# Altium project CXQuadcopter.PrjPCB
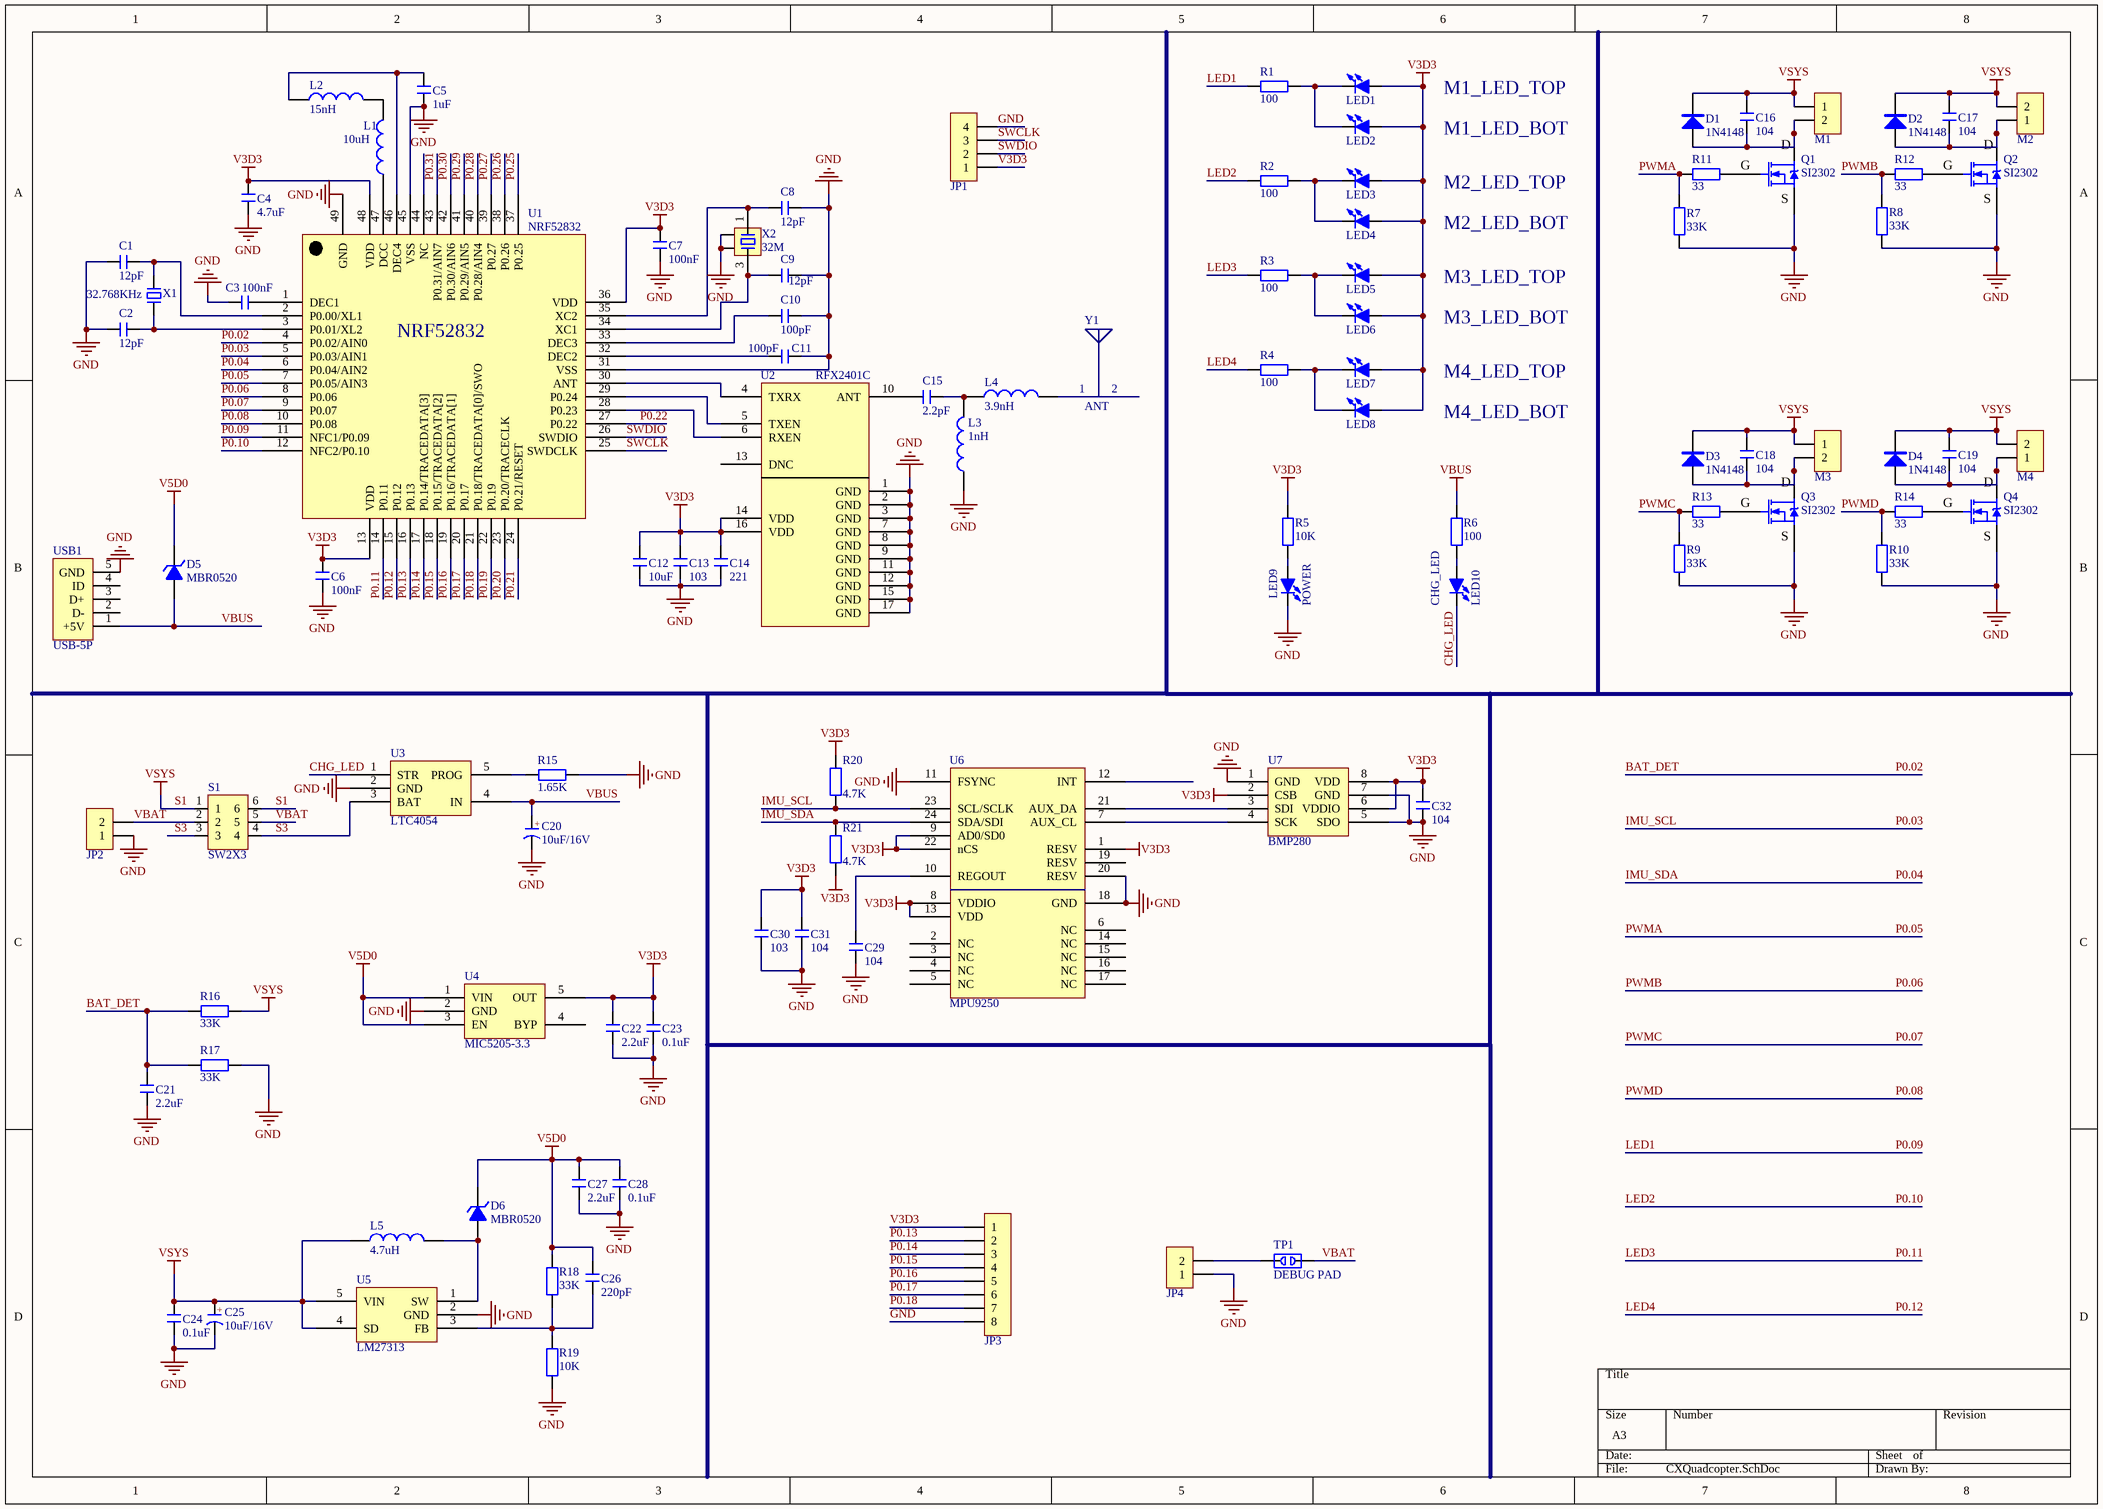
[diagram p0: CXQuadcopter.SchDoc]
1 sheet, 99 parts. Net scope: global (net labels, ports and power ports of the same name join across sheets).

## Sheet CXQuadcopter.SchDoc
size A3

### Parts
C1  12pF  [C 0402]
C2  12pF  [C 0402]
C3  100nF  [C 0402]
C4  4.7uF  [C 0402]
C5  1uF  [C 0402]
C6  100nF  [C 0402]
C7  100nF  [C 0402]
C8  12pF  [C 0402]
C9  12pF  [C 0402]
C10  100pF  [C 0402]
C11  100pF  [C 0402]
C12  10uF  [C 0402]
C13  103  [C 0402]
C14  221  [C 0402]
C15  2.2pF  [C 0402]
C16  104  [C 0402]
C17  104  [C 0402]
C18  104  [C 0402]
C19  104  [C 0402]
C20  10uF/16V  [CD A(3216)]
C21  2.2uF  [C 0603]
C22  2.2uF  [C 0603]
C23  0.1uF  [C 0603]
C24  0.1uF  [C 0603]
C25  10uF/16V  [CD A(3216)]
C26  220pF  [C 0603]
C27  2.2uF  [C 0603]
C28  0.1uF  [C 0603]
C29  104  [C 0603]
C30  103  [C 0603]
C31  104  [C 0603]
C32  104  [C 0603]
D1  1N4148  [MINI_MELF (LL34)]
D2  1N4148  [MINI_MELF (LL34)]
D3  1N4148  [MINI_MELF (LL34)]
D4  1N4148  [MINI_MELF (LL34)]
D5  MBR0520  [DO-35]
D6  MBR0520  [DO-35]
JP1  HDR-1X4  [HDR2.54 S-W-4P]  (value not drawn)
JP2  HDR-1X2  [HDR-1X2]  (value not drawn)
JP3  HDR-1X8  [HDR2.54 S-W-8P_M]  (value not drawn)
JP4  HDR-1X2  [HDR-1X2]  (value not drawn)
L1  10uH  [L 0402]
L2  15nH  [L 0402]
L3  1nH  [L 0402]
L4  3.9nH  [L 0402]
L5  4.7uH  [L 0402]
LED1  红色  [LED 0603R]  (value not drawn)
LED2  红色  [LED 0603R]  (value not drawn)
LED3  红色  [LED 0603R]  (value not drawn)
LED4  红色  [LED 0603R]  (value not drawn)
LED5  红色  [LED 0603R]  (value not drawn)
LED6  红色  [LED 0603R]  (value not drawn)
LED7  红色  [LED 0603R]  (value not drawn)
LED8  红色  [LED 0603R]  (value not drawn)
LED9  POWER  [LED 0603R]
LED10  CHG_LED  [LED 0603R]
M1  HDR-1X2  [HDR-1X2]  (value not drawn)
M2  HDR-1X2  [HDR-1X2]  (value not drawn)
M3  HDR-1X2  [HDR-1X2]  (value not drawn)
M4  HDR-1X2  [HDR-1X2]  (value not drawn)
Q1  SI2302  [SOT23-3N]
Q2  SI2302  [SOT23-3N]
Q3  SI2302  [SOT23-3N]
Q4  SI2302  [SOT23-3N]
R1  100  [R 0603]
R2  100  [R 0603]
R3  100  [R 0603]
R4  100  [R 0603]
R5  10K  [R 0603]
R6  100  [R 0603]
R7  33K  [R 0603]
R8  33K  [R 0603]
R9  33K  [R 0603]
R10  33K  [R 0603]
R11  33  [R 0603]
R12  33  [R 0603]
R13  33  [R 0603]
R14  33  [R 0603]
R15  1.65K  [R 0603]
R16  33K  [R 0603]
R17  33K  [R 0603]
R18  33K  [R 0603]
R19  10K  [R 0603]
R20  4.7K  [R 0603]
R21  4.7K  [R 0603]
S1  SW2X3
TP1  DEBUG PAD  [DEBUG PAD2]
U1  NRF52832
U2  RFX2401C
U3  LTC4054
U4  MIC5205-3.3
U5  LM27313
U6  MPU9250
U7  BMP280
USB1  USB-5P  [USB-MICRO_A]
X1  32.768KHz  [XTAL-3X8H]
X2  32M  [XTAL-5032]
Y1  ANT

### Nets
GND: C1.1 C2.1 C3.1 C4.1 C5.1 C6.1 C7.1 C8.2 C9.2 C10.2 C11.2 C12.1 C13.1 C14.1 C20.2(K) C21.1 C22.1 C23.1 C24.1 C25.2(K) C27.1 C28.1 C29.1 C30.1 C31.1 C32.1 JP1.4 JP2.1 JP3.8 JP4.1 L3.1 LED9.2(K) Q1.2(S) Q2.2(S) Q3.2(S) Q4.2(S) R7.1 R8.1 R9.1 R10.1 R15.2 R17.2 R19.1 U1.31(VSS) U1.45(VSS) U1.49(GND) U2.1(GND) U2.2(GND) U2.3(GND) U2.7(GND) U2.8(GND) U2.9(GND) U2.11(GND) U2.12(GND) U2.15(GND) U2.17(GND) U3.2(GND) U4.2(GND) U5.2(GND) U6.11(FSYNC) U6.18(GND) U6.20(RESV) U7.1(GND) U7.5(SDO) U7.7(GND) USB1.5(GND) X2.2 X2.4
S1: C16.1 C17.1 C18.1 C19.1 C24.2 C25.1(A) D1.2(K) D2.2(K) D3.2(K) D4.2(K) L5.1 M1.1 M2.2 M3.1 M4.2 R16.2 S1.1 S1.6 U5.4(SD) U5.5(VIN)  [also labelled VSYS]
V3D3: C4.2 C6.2 C7.2 C12.2 C13.2 C14.2 C22.2 C23.2 C30.2 C31.2 C32.2 JP1.1 JP3.1 LED1.1(A) LED2.1(A) LED3.1(A) LED4.1(A) LED5.1(A) LED6.1(A) LED7.1(A) LED8.1(A) R5.1 R20.2 R21.1 U1.13(VDD) U1.36(VDD) U1.48(VDD) U2.14(VDD) U2.16(VDD) U4.5(OUT) U6.1(RESV) U6.8(VDDIO) U6.9(AD0/SD0) U6.13(VDD) U6.22(nCS) U7.2(CSB) U7.6(VDDIO) U7.8(VDD)
V5D0: C26.2 C27.2 C28.2 D5.2(K) D6.2(K) R18.2 U4.1(VIN) U4.3(EN)
VBUS: C20.1(A) D5.1(A) R6.1 U3.4(IN) USB1.1(+5V)
BAT_DET: C21.2 R16.1 R17.1 U1.4(P0.02/AIN0)  [also labelled P0.02]
CHG_LED: LED10.2(K) U3.1(STR)
IMU_SCL: R20.1 U1.5(P0.03/AIN1) U6.23(SCL/SCLK)  [also labelled P0.03]
IMU_SDA: R21.2 U1.6(P0.04/AIN2) U6.24(SDA/SDI)  [also labelled P0.04]
LED1: R1.2 U1.11(NFC1/P0.09)  [also labelled P0.09]
LED2: R2.2 U1.12(NFC2/P0.10)  [also labelled P0.10]
LED3: R3.2 U1.14(P0.11)  [also labelled P0.11]
LED4: R4.2 U1.15(P0.12)  [also labelled P0.12]
P0.05: R7.2 R11.2 U1.7(P0.05/AIN3)  [also labelled PWMA]
P0.06: R8.2 R12.2 U1.8(P0.06)  [also labelled PWMB]
P0.07: R9.2 R13.2 U1.9(P0.07)  [also labelled PWMC]
P0.08: R10.2 R14.2 U1.10(P0.08)  [also labelled PWMD]
P0.13: JP3.2 U1.16(P0.13)
P0.14: JP3.3 U1.17(P0.14/TRACEDATA[3])
P0.15: JP3.4 U1.18(P0.15/TRACEDATA[2])
P0.16: JP3.5 U1.19(P0.16/TRACEDATA[1])
P0.17: JP3.6 U1.20(P0.17)
P0.18: JP3.7 U1.21(P0.18/TRACEDATA[0]/SWO)
P0.19: U1.22(P0.19)
P0.20: U1.23(P0.20/TRACECLK)
P0.21: U1.24(P0.21/RESET)
P0.22: U1.27(P0.22)
P0.25: U1.37(P0.25)
P0.26: U1.38(P0.26)
P0.27: U1.39(P0.27)
P0.28: U1.40(P0.28/AIN4)
P0.29: U1.41(P0.29/AIN5)
P0.30: U1.42(P0.30/AIN6)
P0.31: U1.43(P0.31/AIN7)
S3: S1.3 S1.4 U3.3(BAT)
SWCLK: JP1.3 U1.25(SWDCLK)
SWDIO: JP1.2 U1.26(SWDIO)
VBAT: JP2.2 S1.2 S1.5 TP1.2
NetC1_2: C1.2 U1.2(P0.00/XL1) X1.2
NetC2_2: C2.2 U1.3(P0.01/XL2) X1.1
NetC3_2: C3.2 U1.1(DEC1)
NetC5_2: C5.2 L2.1 U1.46(DEC4)
NetC8_1: C8.1 U1.35(XC2) X2.1
NetC9_1: C9.1 U1.34(XC1) X2.3
NetC10_1: C10.1 U1.33(DEC3)
NetC11_1: C11.1 U1.32(DEC2)
NetC15_1: C15.1 L3.2 L4.1
NetC15_2: C15.2 U2.10(ANT)
NetC16_2: C16.2 D1.1(A) M1.2 Q1.3(D)
NetC17_2: C17.2 D2.1(A) M2.1 Q2.3(D)
NetC18_2: C18.2 D3.1(A) M3.2 Q3.3(D)
NetC19_2: C19.2 D4.1(A) M4.1 Q4.3(D)
NetC26_1: C26.1 R18.1 R19.2 U5.3(FB)
NetC29_2: C29.2 U6.10(REGOUT)
NetD6_1: D6.1(A) L5.2 U5.1(SW)
NetJP4_2: JP4.2 TP1.1
NetL1_1: L1.1 U1.47(DCC)
NetL1_2: L1.2 L2.2
NetL4_2: L4.2 Y1.1
NetLED1_2: LED1.2(K) LED2.2(K) R1.1
NetLED3_2: LED3.2(K) LED4.2(K) R2.1
NetLED5_2: LED5.2(K) LED6.2(K) R3.1
NetLED7_2: LED7.2(K) LED8.2(K) R4.1
NetLED9_1: LED9.1(A) R5.2
NetLED10_1: LED10.1(A) R6.2
NetQ1_1: Q1.1(G) R11.1
NetQ2_1: Q2.1(G) R12.1
NetQ3_1: Q3.1(G) R13.1
NetQ4_1: Q4.1(G) R14.1
NetR15_1: R15.1 U3.5(PROG)
NetU1_28: U1.28(P0.23) U2.6(RXEN)
NetU1_29: U1.29(P0.24) U2.5(TXEN)
NetU1_30: U1.30(ANT) U2.4(TXRX)
NetU6_7: U6.7(AUX_CL) U7.4(SCK)
NetU6_21: U6.21(AUX_DA) U7.3(SDI)

Not connected (* = marked no-connect by the designer): U1 44(NC); U2 13(DNC); U4 4(BYP); U6 2(NC) 3(NC) 4(NC) 5(NC) 6(NC) 12(INT) 14(NC) 15(NC) 16(NC) 17(NC) 19(RESV); USB1 2(D-) 3(D+) 4(ID); Y1 2

### Notes on the sheet
- M1_LED_TOP
- M1_LED_BOT
- M2_LED_TOP
- M2_LED_BOT
- M3_LED_TOP
- M3_LED_BOT
- M4_LED_TOP
- M4_LED_BOT
- (in symbol C-CD) +

### Library data of the parts
C1-C19 C21-C24 C26-C32 = C: 无极性贴片电容; 版权归属: 黎明电子style; BOM名称: 无极性贴片电容; 学习资源: https://lmdzstyle.taobao.com/
C20 C25 = C-CD: 贴片钽电容; 版权归属: 黎明电子style; BOM名称: 贴片钽电容; 学习资源: https://lmdzstyle.taobao.com/
D1-D4 = 1N4148: 高速开关二极管; 版权归属: 黎明电子style; BOM名称: 高速开关二极管; 学习资源: https://lmdzstyle.taobao.com/
D5 D6 = 1N4106: 12V/0.5W稳压管; 版权归属: 黎明电子style; BOM名称: 12V/0.5W稳压管; 学习资源: https://lmdzstyle.taobao.com/
JP1 = Header 4: 4P接插件; 版权归属: 黎明电子style; BOM名称: 4P接插件; 学习资源: https://lmdzstyle.taobao.com/
JP2 JP4 M1-M4 = Header 2: 2P接插件; 版权归属: 黎明电子style; BOM名称: 2P接插件; 学习资源: https://lmdzstyle.taobao.com/
JP3 = Header 8: 8P接插件; 版权归属: 黎明电子style; BOM名称: 8P接插件; 学习资源: https://lmdzstyle.taobao.com/
L1-L5 = L: 小功率贴片电感; 版权归属: 黎明电子style; BOM名称: 小功率贴片电感; 学习资源: https://lmdzstyle.taobao.com/
LED1-LED10 = LED-SMD: 贴片LED; 版权归属: 黎明电子style; BOM名称: 贴片LED; 学习资源: https://lmdzstyle.taobao.com/
Q1-Q4 = SI2302: N沟道场效应管; 版权归属: 黎明电子style; BOM名称: N沟道场效应管; 学习资源: https://lmdzstyle.taobao.com/
R1-R21 = R: 贴片电阻; 版权归属: 黎明电子style; BOM名称: 贴片电阻; 学习资源: https://lmdzstyle.taobao.com/
S1 = Switch
TP1 = DEBUG: 调试断点焊盘; 版权归属: 黎明电子style; BOM名称: 调试断点焊盘; 学习资源: https://lmdzstyle.taobao.com/
USB1 = USB-5P: 微型USB母座; 版权归属: 黎明电子style; BOM名称: 微型USB母座; 学习资源: https://lmdzstyle.taobao.com/
X1 = XTAL-2: 2脚晶振; 版权归属: 黎明电子style; BOM名称: 2脚晶振; 学习资源: https://lmdzstyle.taobao.com/
X2 = XTAL-4: 4脚晶振; 版权归属: 黎明电子style; BOM名称: 4脚晶振; 学习资源: https://lmdzstyle.taobao.com/